# Altium project DS131-1.0-BpH传感器.PrjPCB
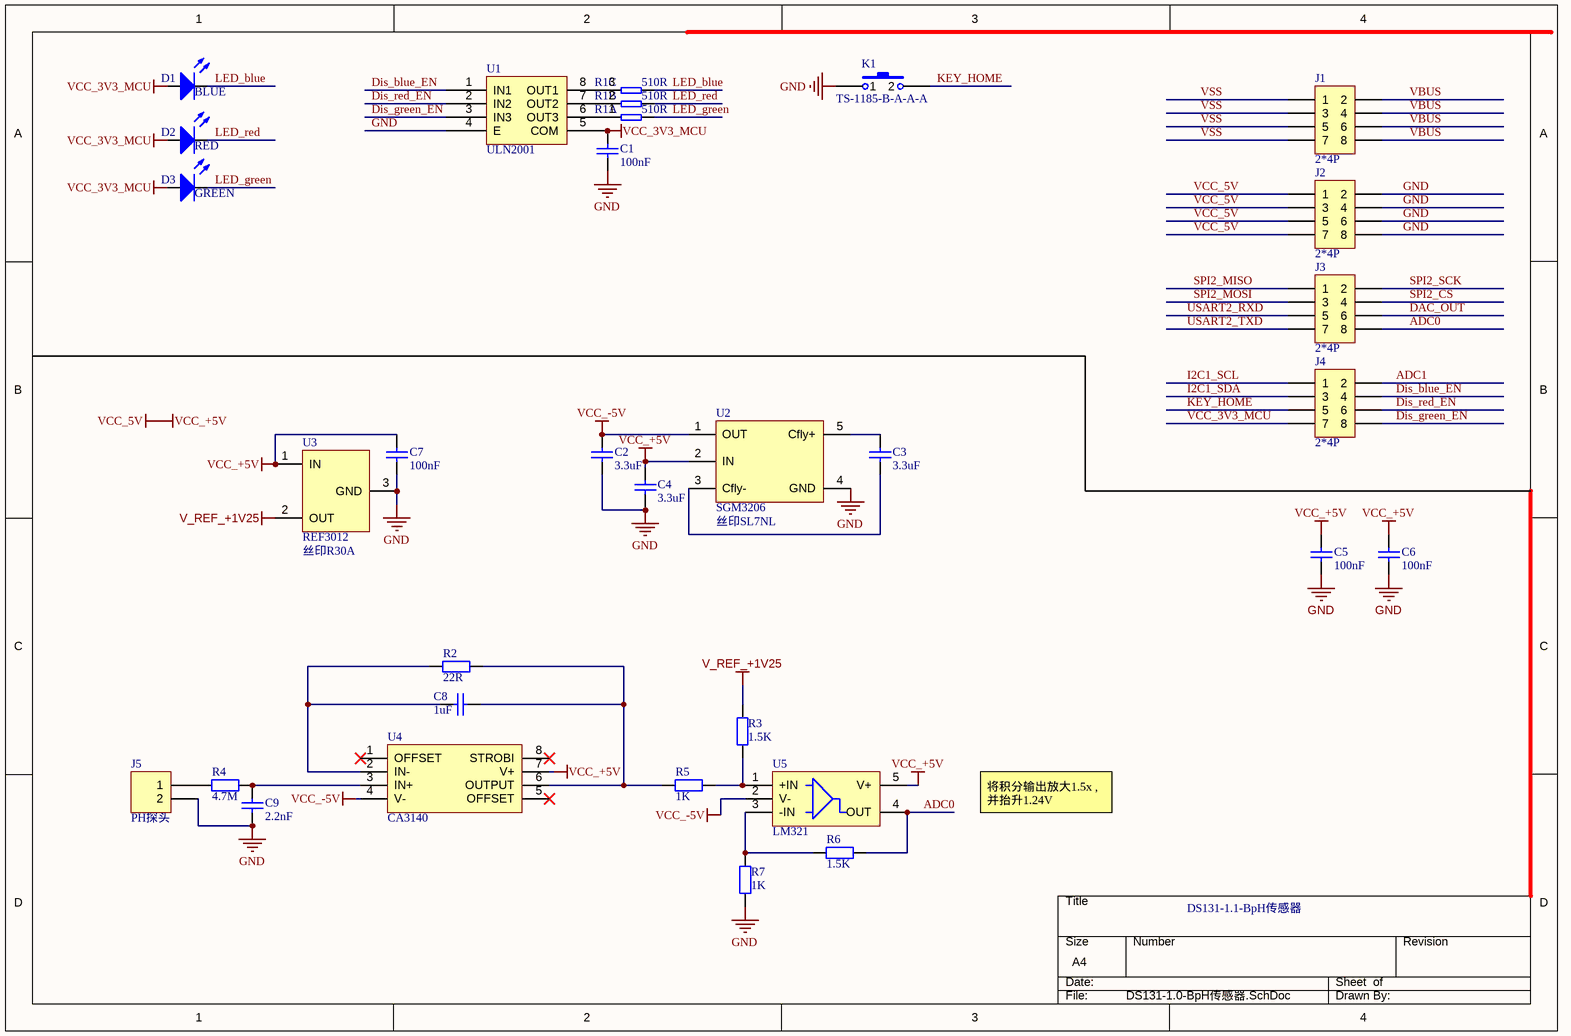
[diagram p0: DS131-1.0-BpH传感器.SchDoc]
1 sheet, 30 parts. Net scope: global (net labels, ports and power ports of the same name join across sheets).
Board file: DS131-1.0-BpH传感器.PcbDoc

## Sheet DS131-1.0-BpH传感器.SchDoc
size A4

### Parts
C1  value 100nF  [0603CAP]  (hidden comment: SMDCAP00013)
C2  value 3.3uF  [0603CAP]  (hidden comment: MLCC 3.3uF 50V ±10％ 0603)
C3  value 3.3uF  [0603CAP]  (hidden comment: MLCC 3.3uF 50V ±10％ 0603)
C4  value 3.3uF  [0603CAP]  (hidden comment: MLCC 3.3uF 50V ±10％ 0603)
C5  value 100nF  [0603CAP]  (hidden comment: SMDCAP00013)
C6  value 100nF  [0603CAP]  (hidden comment: SMDCAP00013)
C7  value 100nF  [0603CAP]  (hidden comment: SMDCAP00013)
C8  value 1uF  [0603CAP]  (hidden comment: SMDCAP00015)
C9  value 2.2nF  [0603CAP]
D1  value BLUE  [LED_0805]  (hidden comment: SMDLED00010)
D2  value RED  [LED_0805]  (hidden comment: SMDLED00003)
D3  value GREEN  [LED_0805]  (hidden comment: Chip 翠绿LED 0805)
J1  value 2*4P  [X1321WVS-2x04J-C40D53]  (hidden comment: X1321WVS-2x04J-C40D53)
J2  value 2*4P  [X1321WVS-2x04J-C40D53]  (hidden comment: X1321WVS-2x04J-C40D53)
J3  value 2*4P  [X1321WVS-2x04J-C40D53]  (hidden comment: X1321WVS-2x04J-C40D53)
J4  value 2*4P  [X1321WVS-2x04J-C40D53]  (hidden comment: X1321WVS-2x04J-C40D53)
J5  value PH探头  [SIP2]  (hidden comment: SL000000042)
K1  TS-1185-B-A-A-A  [KEY_TS-1185-x-A-A-A]
R1  value 510R  [0603RES_Pack4]  (hidden comment: SMDRES05003)  (parts A,B,C of 4)
R2  value 22R  [0603RES]
R3  value 1.5K  [0603RES]  (hidden comment: SMDRES00039)
R4  value 4.7M  [0603RES]  (hidden comment: Chip 4.7M 1/16W ±1％ 0603)
R5  value 1K  [0603RES]  (hidden comment: SMDRES00034)
R6  value 1.5K  [0603RES]  (hidden comment: SMDRES00039)
R7  value 1K  [0603RES]  (hidden comment: SMDRES00034)
U1  value ULN2001  [SO-8]  (hidden comment: SMDIC000018)
U2  SGM3206  value 丝印SL7NL  [SOT23-5]
U3  REF3012  value 丝印R30A  [SOT23]
U4  CA3140  [SO-8]
U5  value LM321  [SOT23-5]  (hidden comment: SMDIC000035)

### Nets
GND: C1.1 C2.1 C4.2 C5.1 C6.1 C7.1 C9.1 J2.2 J2.4 J2.6 J2.8 J5.2 K1.1 R7.1 U1.4(E) U2.4(GND) U3.3(GND)
V_REF_+1V25: R3.1 U3.2(OUT)
VCC_3V3_MCU: C1.2 D1.1(A) D2.1(A) D3.1(A) J4.7 U1.5(COM)
VCC_5V: C4.1 C5.2 C6.2 C7.2 J2.1 J2.3 J2.5 J2.7 U2.2(IN) U3.1(IN) U4.7(V+) U5.5(V+)  [also labelled VCC_+5V]
VCC_-5V: C2.2 U2.1(OUT) U4.4(V-) U5.2(V-)
ADC0: J3.8 R6.2 U5.4(OUT)
ADC1: J4.2
DAC_OUT: J3.6
Dis_blue_EN: J4.4 U1.1(IN1)
Dis_green_EN: J4.8 U1.3(IN3)
Dis_red_EN: J4.6 U1.2(IN2)
I2C1_SCL: J4.1
I2C1_SDA: J4.3
KEY_HOME: J4.5 K1.2
LED_blue: D1.2(K) R1.6
LED_green: D3.2(K) R1.8
LED_red: D2.2(K) R1.7
SPI2_CS: J3.4
SPI2_MISO: J3.1
SPI2_MOSI: J3.3
SPI2_SCK: J3.2
USART2_RXD: J3.5
USART2_TXD: J3.7
VBUS: J1.2 J1.4 J1.6 J1.8
VSS: J1.1 J1.3 J1.5 J1.7
NetC3_1: C3.1 U2.5(Cfly+)
NetC3_2: C3.2 U2.3(Cfly-)
NetC8_1: C8.1 R2.1 U4.2(IN-)
NetC8_2: C8.2 R2.2 R5.1 U4.6(OUTPUT)
NetC9_2: C9.2 R4.2 U4.3(IN+)
NetJ5_1: J5.1 R4.1
NetR1_1: R1.1 U1.6(OUT3)
NetR1_2: R1.2 U1.7(OUT2)
NetR1_3: R1.3 U1.8(OUT1)
NetR3_2: R3.2 R5.2 U5.1(+IN)
NetR6_1: R6.1 R7.2 U5.3(-IN)

Not connected (* = marked no-connect by the designer): U4 1(OFFSET)* 5(OFFSET)* 8(STROBI)*

### Notes on the sheet
- 将积分输出放大1.5x , 并抬升1.24V
- DS131-1.1-BpH传感器
- DWG. NO.
- REV.
- SHT.
- THIS DOCUMENT AND THE DATA DISCLOSED HEREIN OR HEREWITH IS THE PROPERTY OF ALTIUM LIMITED AND MAY BE FREELY DISTRIBUTED IN WHOLE. NO RIGHTS ARE RESERVED OR EXPRESS OR IMPLIED WARANTEE GIVEN.
- REVISION
- DESCRIPTION
- DATE
- APPROVED
- ENG:
- APPROVALS
- PROJECT
- DSN:
- CHK:
- REFERENCE DOCUMENTS
- PROJECT REVISION:
- TITLE
- DOCUMENT REVISION:
- DESIGN ITEM:
- BOM:
- FAB DWG:
- PCB DWG:
- ASSY DWG:
- SCALE:
- SIZE
- B
- CAGE CODE
- FILE NAME
- DWG NO.
- SHEET
- OF
- REV

### Library data of the parts
C1 C5-C7 = MLCC 100nF 50V ±10％ 0603: 贴片电容
C2-C4 = MLCC 3.3uF 50V ±10％ 0603: 贴片电容
C8 = MLCC 1uF 50V ±10％ 0603: 贴片电容
C9 = MLCC 2.2nF 50V ±10％ 0603: 贴片电容
D1 = Chip 蓝色LED 0805: 贴片LED
D2 = Chip 红色LED 0805: 贴片LED
D3 = Chip 翠绿LED 0805: 贴片LED
J1-J4 = X1321WVS-2x04J-C40D53: 双排针2x4P 立贴 1.27mm
J5 = DIP2 单排直针 1*40P 间距2.54mm 针长11mm 铜: 单排直针
K1 = TS-1185-B-A-A-A: 轻触开关; Value: TS-1185-B-A-A-A
R1 = Chip R*4 510R 1/16W ±5％ 0603: 贴片排阻
R2 = Chip 22R 1/16W ±1％ 0603: 贴片电阻
R3 R6 = Chip 1.5K 1/16W ±1％ 0603: 贴片电阻
R4 = Chip 4.7M 1/16W ±1％ 0603: 贴片电阻
R5 R7 = Chip 1K 1/16W ±1％ 0603: 贴片电阻
U1 = ULN2001 SOP-8: 电机驱动芯片
U2 = SGM3206: SGMICRO(圣邦微) / SGM3206YN5G/TR / SOT-23-5
U3 = REF3012: TI / REF3012AIDBZR / SOT-23
U4 = CA3140: RENESAS(瑞萨) / CA3140AMZ96 / SOIC-8
U5 = LM321 SOT23-5: TI / LM321MFX/NOPB / SOT-23-5